# Altium schematic sheet FPGA microSD.SchDoc
size A; SheetNumber: 11; SheetTotal: 16
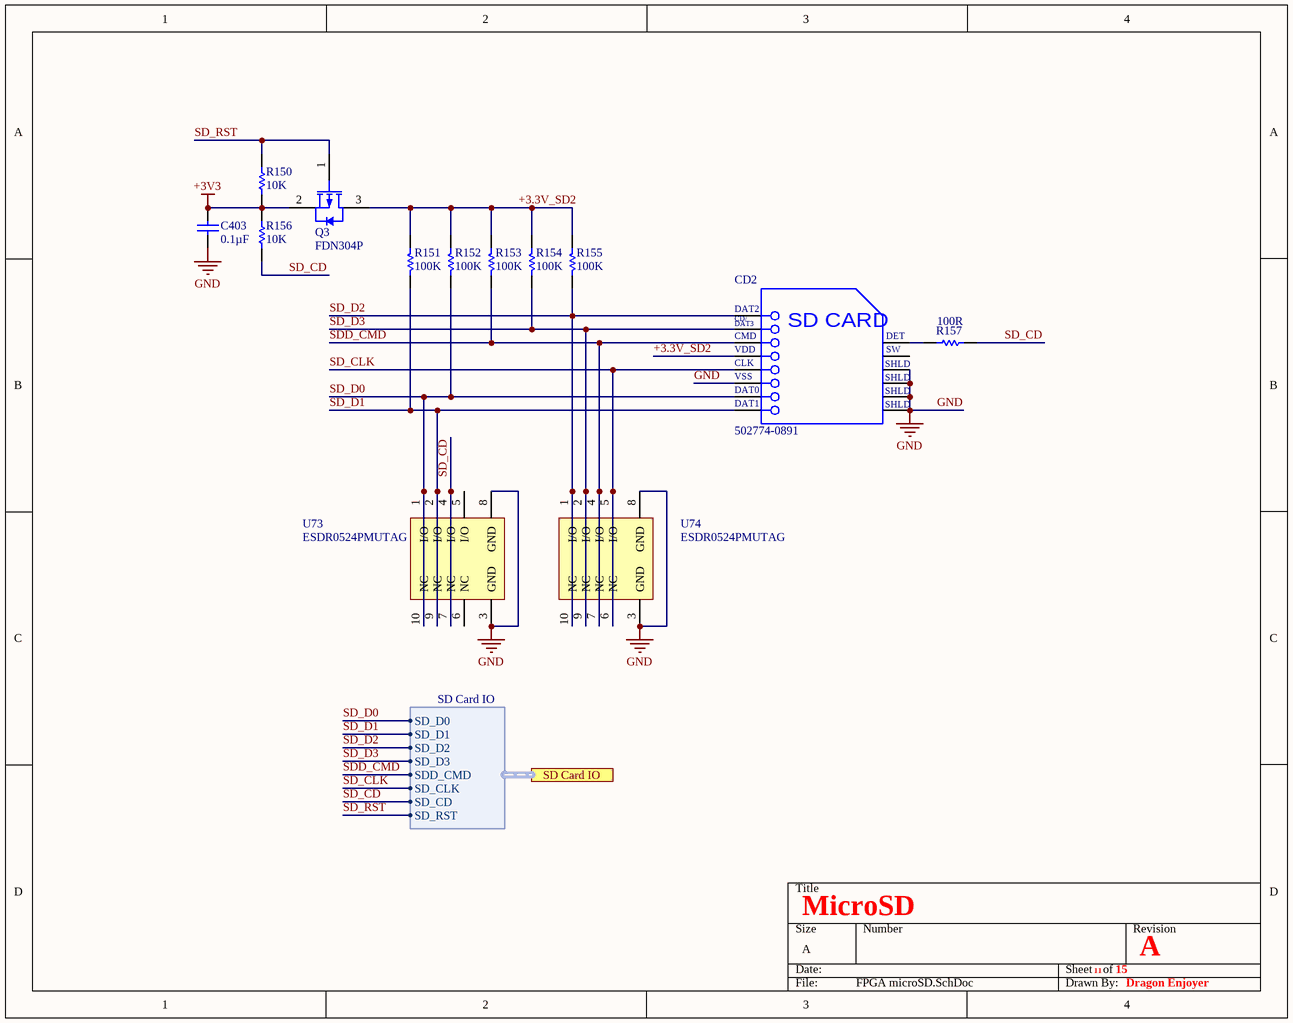
[diagram p0: FPGA microSD.SchDoc]

## Parts
C403  Capacitance: 0.1µF  [CAPC1005X55X25LL05T05]  (hidden comment: CC0402ZRY5V8BB104)
CD2  502774-0891  [MOLX-502774-0891_V]
Q3  FDN304P  [FAIR-SSOT3L-3_V]
R150  10K  [RESC1609X50X30NL8T20]
R151  value 100K  [RESC1005X40X25LL05T05]  (hidden comment: CRCW0402100KJNED)
R152  value 100K  [RESC1005X40X25LL05T05]  (hidden comment: CRCW0402100KJNED)
R153  value 100K  [RESC1005X40X25LL05T05]  (hidden comment: CRCW0402100KJNED)
R154  value 100K  [RESC1005X40X25LL05T05]  (hidden comment: CRCW0402100KJNED)
R155  value 100K  [RESC1005X40X25LL05T05]  (hidden comment: CRCW0402100KJNED)
R156  10K  [RESC1609X50X30NL8T20]
R157  value 100R  [RESC1005X40X25ML05T10]  (hidden comment: RC0402FR-07100RL)
U73  ESDR0524PMUTAG  [ONSC-UDFN-10-517BB-01_V]
U74  ESDR0524PMUTAG  [ONSC-UDFN-10-517BB-01_V]

## Ports
SD Card IO (harness SD Card IO)

## Harnesses
SD Card IO: SD_D0, SD_D1, SD_D2, SD_D3, SDD_CMD, SD_CLK, SD_CD, SD_RST

## Nets
+3V3: C403.2 Q3.2(SOURCE) R150.1 R156.2
GND: C403.1 CD2.6(VSS) CD2.11(SHLD) CD2.12(SHLD) CD2.13(SHLD) CD2.14(SHLD) U73.3(GND) U73.8(GND) U74.3(GND) U74.8(GND)
+3.3V_SD2: CD2.4(VDD) Q3.3(DRAIN) R151.1 R152.1 R153.1 R154.1 R155.1
SD_CD: R156.1 R157.2 U73.4(I/O) U73.7(NC) ; port SD Card IO.SD_CD
SD_CLK: CD2.5(CLK) U74.5(I/O) U74.6(NC) ; port SD Card IO.SD_CLK
SD_D0: CD2.7(DAT0) R152.2 U73.1(I/O) U73.10(NC) ; port SD Card IO.SD_D0
SD_D1: CD2.8(DAT1) R151.2 U73.2(I/O) U73.9(NC) ; port SD Card IO.SD_D1
SD_D2: CD2.1(DAT2) R155.2 U74.1(I/O) U74.10(NC) ; port SD Card IO.SD_D2
SD_D3: CD2.2(CD/DAT3) R154.2 U74.2(I/O) U74.9(NC) ; port SD Card IO.SD_D3
SD_RST: Q3.1(GATE) R150.2 ; port SD Card IO.SD_RST
SDD_CMD: CD2.3(CMD) R153.2 U74.4(I/O) U74.7(NC) ; port SD Card IO.SDD_CMD
NetCD2_9: CD2.9(DETECT) R157.1

Not connected (* = marked no-connect by the designer): CD2 10(SWITCH); U73 5(I/O) 6(NC)

## Notes on the sheet
- MicroSD
- 11
- 15
- A
- Dragon Enjoyer
- (in symbol CMP-2000-05248-1) CD/; DAT3; SD CARD; DET; SW

## Library data of the parts
C403 = CMP-2000-06071-1: Chip Capacitor, 100 nF, -20% to 80%, 25 V, -30 to 85 degC, 0402 (1005 Metric), RoHS, Tape and Reel; Manufacturer: Yageo; Online Catalog: CCSeries; Tolerance: -20%,+80%; Voltage - Rated: 25V; Product Training Modules: MultilayerCeramicCapacitors; Catalog Drawings: CC_0402; Other Names: 311-1375-6; Temperature Coefficient: Y5V(F); Datasheet URL: http://www.farnell.com/datasheets/1132289.pdf; Features: -; Package Description: 2-Pin Surface Mount Device, Body 1 x 0.5 mm; Standard Package: 1; Mounting Technology: SurfaceMount; Lead Style: -; Thickness (Max): 0.022"(0.55mm); Family: CeramicCapacitors; Series: CC; Applications: GeneralPurpose; Lead Spacing: -; Size / Dimension: 0.039"Lx0.020"W(1.00mmx0.50mm); Manufacturer URL: http://www.yageo.com/; Category: Capacitors; Datasheet Version: Rev. 5, 07/2010; Height - Seated (Max): -; Packaging: Digi-Reel®; Operating Temperature: -30°C~85°C; Mounting Type: SurfaceMount,MLCC; Package Reference: 0402; Ratings: -; Package / Case: 0402(1005Metric)
CD2 = CMP-2000-05248-1: Micro SD Memory Card Connector, 0.5 A, 10 V (DC), -25 to 85 degC, 8-Pin SMT, RoHS, Tape and Reel; Manufacturer: Molex; 3D Model: 502774-0891.stp; Online Catalog: microSD™Series; Number of Positions: 10(8+2); Card Type: SecureDigital-microSD™; Insertion, Removal Method: PushIn,PushOut; Other Names: WM24066DKR; Connector Type: ConnectorandEjector; Features: Switch; Family: MemoryConnectors-PCCardSockets; Manufacturer URL: http://www.molex.com/; Mounting Type: SurfaceMount,RightAngle; Contact Finish Thickness: 20µin(0.51µm); Standard Package: 1; Series: 502774; Ejector Side: -; Datasheet Version: Rev. D, 04/2004; Category: Connectors,Interconnects; Contact Finish: Gold; Datasheet URL: https://datasheet.ciiva.com/1104/1499551-1104671.pdf; RoHS Information: 502774-0891CertofCompliance; Mounting Feature: Reverse-Bottom; Packaging: Digi-Reel; Height Above Board: 0.071"(1.80mm); Catalog Drawings: 502774-0891
Q3 = CMP-2000-06247-1: P-Channel Specified Power Trench(R) MOSFET, 1.8 V, -55 to 150 degC, 3-Pin SSOT, RoHS, Tape and Reel; Manufacturer: Fairchild Semiconductor; Reel Quantity: 3000; Drain Source Voltage Vds: 20V; Power Dissipation Pd: 500mW; On Resistance Rds(on): 52mohm; Full Power Rating Temperature: 25°C; Voltage Vgs Max: -800mV; Pulse Current Idm: 10A; Rds(on) Test Voltage Vgs: -4.5V; External Depth: 2.5mm; Transistor Case Style: SOT-23; No. of Pins: 3; Continuous Drain Current Id: 2.4A; Voltage Vds Typ: -20V; Voltage Vgs th Max: -1.5V; Transistor Polarity: PChannel; Package Version: Rev. 3, 05/2015; External Width: 3.05mm; External Length / Height: 1.12mm; SMD Marking: 304P; SVHC: NoSVHC(19-Dec-2012); Termination Type: SMD; Datasheet URL: https://www.fairchildsemi.com/datasheets/FD/FDN304P.pdf; Tape Width: 8mm; Mounting Technology: SurfaceMount; Voltage Vgs Rds on Measurement: -4.5V; Operating Temperature Range: -55°Cto+150°C; Current Temperature: 25°C; Operating Temperature Min: -55°C; Threshold Voltage Vgs Typ: -800mV; Package / Case: SOT-23; Manufacturer URL: https://www.fairchildsemi.com/; Voltage Vds: 20V; Datasheet Version: Rev. C, 01/2001; Operating Temperature Max: 150°C; Package Description: 3-Pin Small Outline Transistor, Body 2.92 x 1.4 mm, Pitch 0.95 mm; Current Id Max: 2.4A; Package URL: https://www.fairchildsemi.com/package-drawings/MA/MA03B.pdf; Package Reference: SSOT3L
R150 R156 = CMP-1666-00005-4: Chip Resistor, 10 KOhm, +/- 1%, 100 mW, -55 to 155 degC, 0603 (1608 Metric), RoHS, Tape and Reel; Manufacturer: Vishay Semiconductor; Voltage Rating: 75 V; Max Operating Temperature: 155 degC; PackageDescription: 2-Pin Surface Mount Device, Body 1.575 x 0.85 mm; ComponentLink1Description: Manufacturer URL; RoHSCompliant: true; PackageReference: 0603; REACH SVHC: Unknown; Length: 1.55 mm; DatasheetVersion: 06/2012; Packaging: Tape and Reel; Min Operating Temperature: -55 degC; Mounting Technology: Surface Mount; ComponentLink2URL: https://datasheet.ciiva.com/11809/0900766b80d98afc-11809037.pdf; Height: 0.45 mm; ComponentLink2Description: Datasheet; Package Quantity: 5000; ComponentLink1URL: http://www.vishay.com/
R151-R155 = CMP-2002-08125-1: Manufacturer: Vishay Dale; Part Number: CRCW0402100KJNED
R157 = CMP-2002-07344-1: Manufacturer: Yageo / Phycomp; Part Number: RC0402FR-07100RL
U73 U74 = CMP-1063-00245-1: Transient Voltage Suppressor, Low Capacitance ESD Protection for High Speed Data, 10-Pin UDFN, Pb-Free, Tape and Reel; Manufacturer: On Semiconductor; VRWM Max (V): 5; Number of Lines: 4; IR Max (uA): 1; V(BR) Min (V): 5.5; Direction: Unidirectional; PackageReference: UDFN-10-517BB-01; RoHS: Pb-Free; ComponentLink1Description: Manufacturer URL; ComponentLink3URL: http://www.onsemi.com/pub_link/Collateral/517BB.PDF; DatasheetVersion: Rev. 4; Mounting Technology: Surface Mount; PartNumber: ESDR0524PMUTAG; PackageDescription: 10-Pin Small Outline No-Lead, Body 2.5 x 1 mm, Pitch 0.5 mm; ComponentLink3Description: Package Specification; ComponentLink2URL: http://www.onsemi.cn/pub_link/Collateral/ESDR0524P-D.PDF; PackageVersion: Rev. O, 11/2009; ComponentLink2Description: Datasheet; Packing: Tape and Reel; ComponentLink1URL: http://www.onsemi.com/